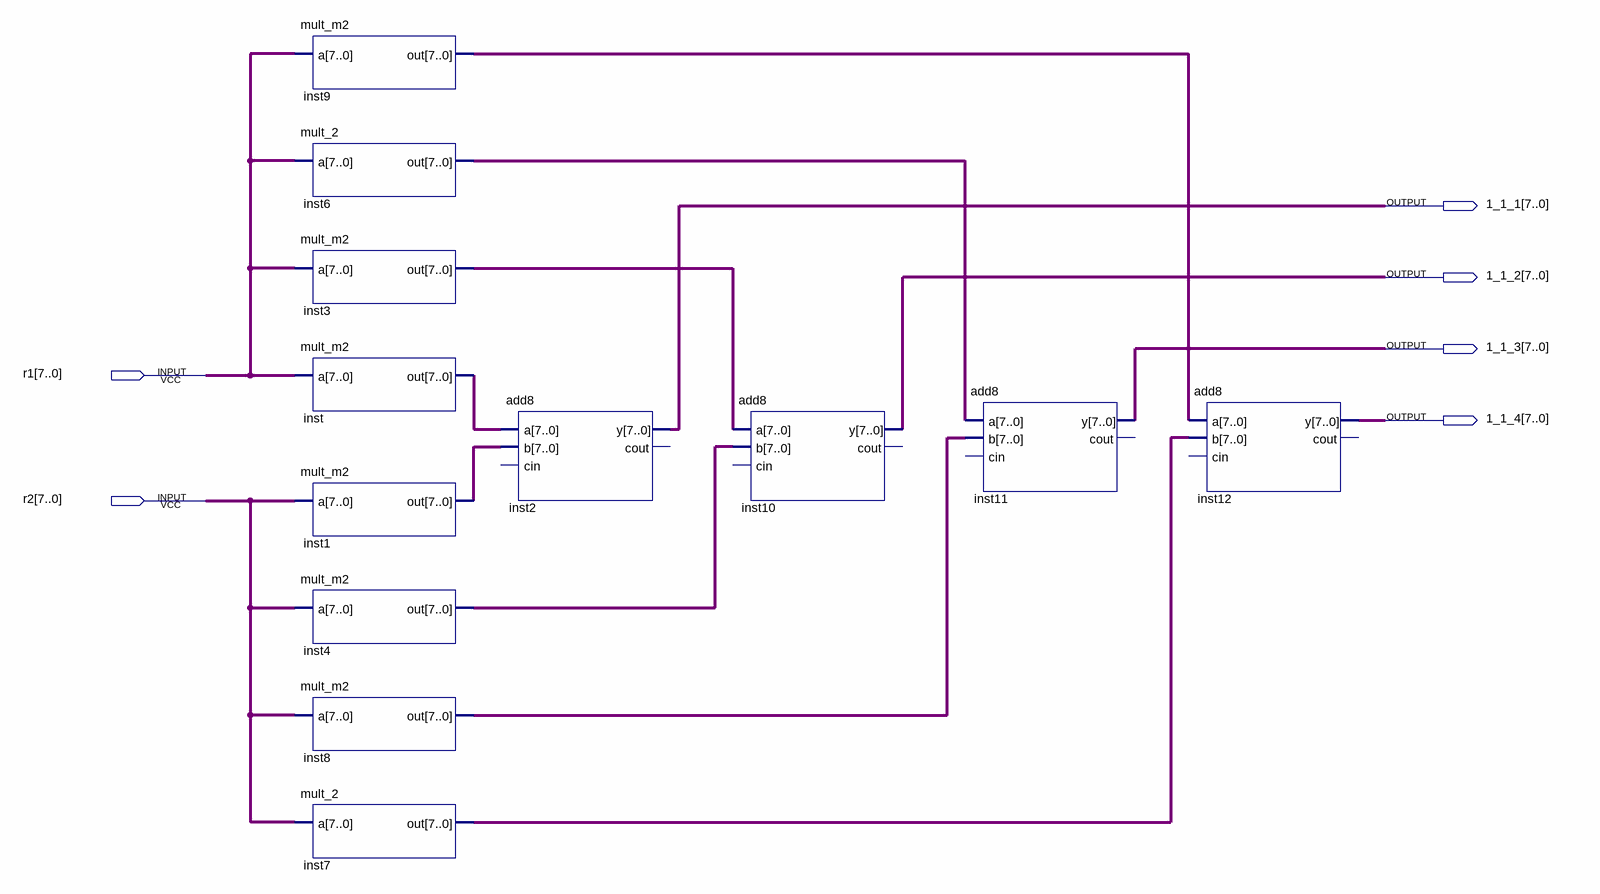
[diagram p0: schematic sheet]
// Quartus schematic stage_1.bdf as structural Verilog: 12 symbols, 6 pins
module stage_1 (
  input  [7:0] r1,
  input  [7:0] r2,
  output [7:0] \1_1_1 ,
  output [7:0] \1_1_2 ,
  output [7:0] \1_1_3 ,
  output [7:0] \1_1_4 
);

  wire [7:0] inst1_out, inst3_out, inst4_out, inst6_out, inst7_out, inst8_out, inst9_out, inst_out;

  mult_m2 inst9 (.a(r1), .out(inst9_out));
  mult_2 inst6 (.a(r1), .out(inst6_out));
  mult_m2 inst3 (.a(r1), .out(inst3_out));
  mult_m2 inst (.a(r1), .out(inst_out));
  mult_m2 inst1 (.a(r2), .out(inst1_out));
  mult_m2 inst4 (.a(r2), .out(inst4_out));
  mult_m2 inst8 (.a(r2), .out(inst8_out));
  mult_2 inst7 (.a(r2), .out(inst7_out));
  add8 inst2 (.a(inst_out), .b(inst1_out), .y(\1_1_1 ));  // open: cin, cout
  add8 inst10 (.a(inst3_out), .b(inst4_out), .y(\1_1_2 ));  // open: cin, cout
  add8 inst11 (.a(inst6_out), .b(inst8_out), .y(\1_1_3 ));  // open: cin, cout
  add8 inst12 (.a(inst9_out), .b(inst7_out), .y(\1_1_4 ));  // open: cin, cout
endmodule
